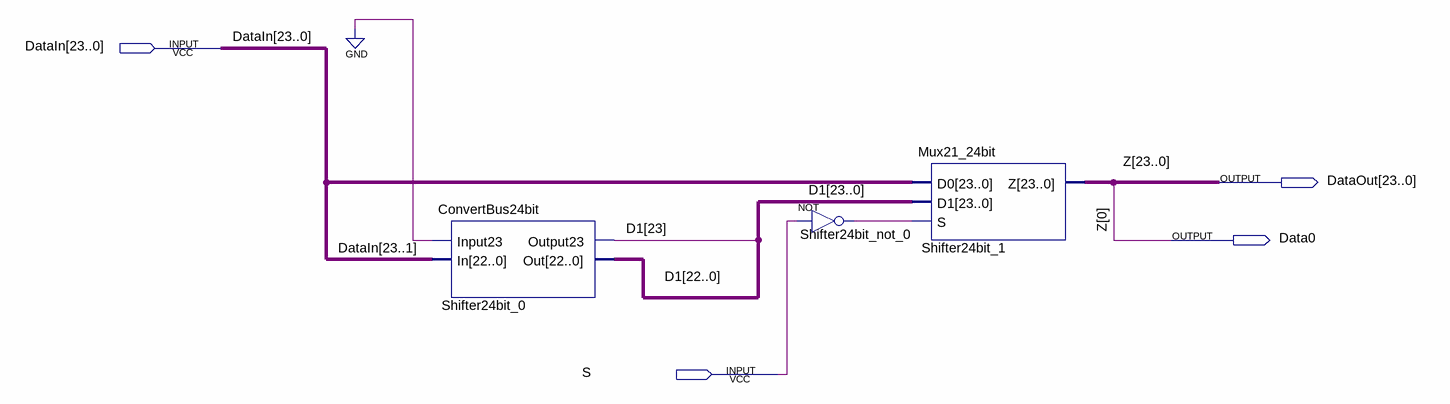
[diagram p0: schematic sheet]
// Quartus schematic ShifRight_1bit_24bit.bdf as structural Verilog: 3 symbols, 4 pins
module ShifRight_1bit_24bit (
  input  [23:0] DataIn,
  input  S,
  output [23:0] DataOut,
  output Data0
);

  wire Shifter24bit_not_0_out;
  wire [23:0] D1;

  ConvertBus24bit Shifter24bit_0 (.Input23(1'b0), .In(DataIn[23:1]), .Output23(D1[23]), .Out(D1[22:0]));
  not Shifter24bit_not_0 (Shifter24bit_not_0_out, S);
  Mux21_24bit Shifter24bit_1 (.D0(DataIn), .D1(D1), .S(Shifter24bit_not_0_out), .Z({DataOut[23:1], Data0}));

  assign DataOut[0] = Data0;

  // Other names for the same wires on the sheet: Z[23:0] = {DataOut[23:1], Data0}
endmodule
